# EAGLE schematic ROMS (EAGLE 9.6.2)
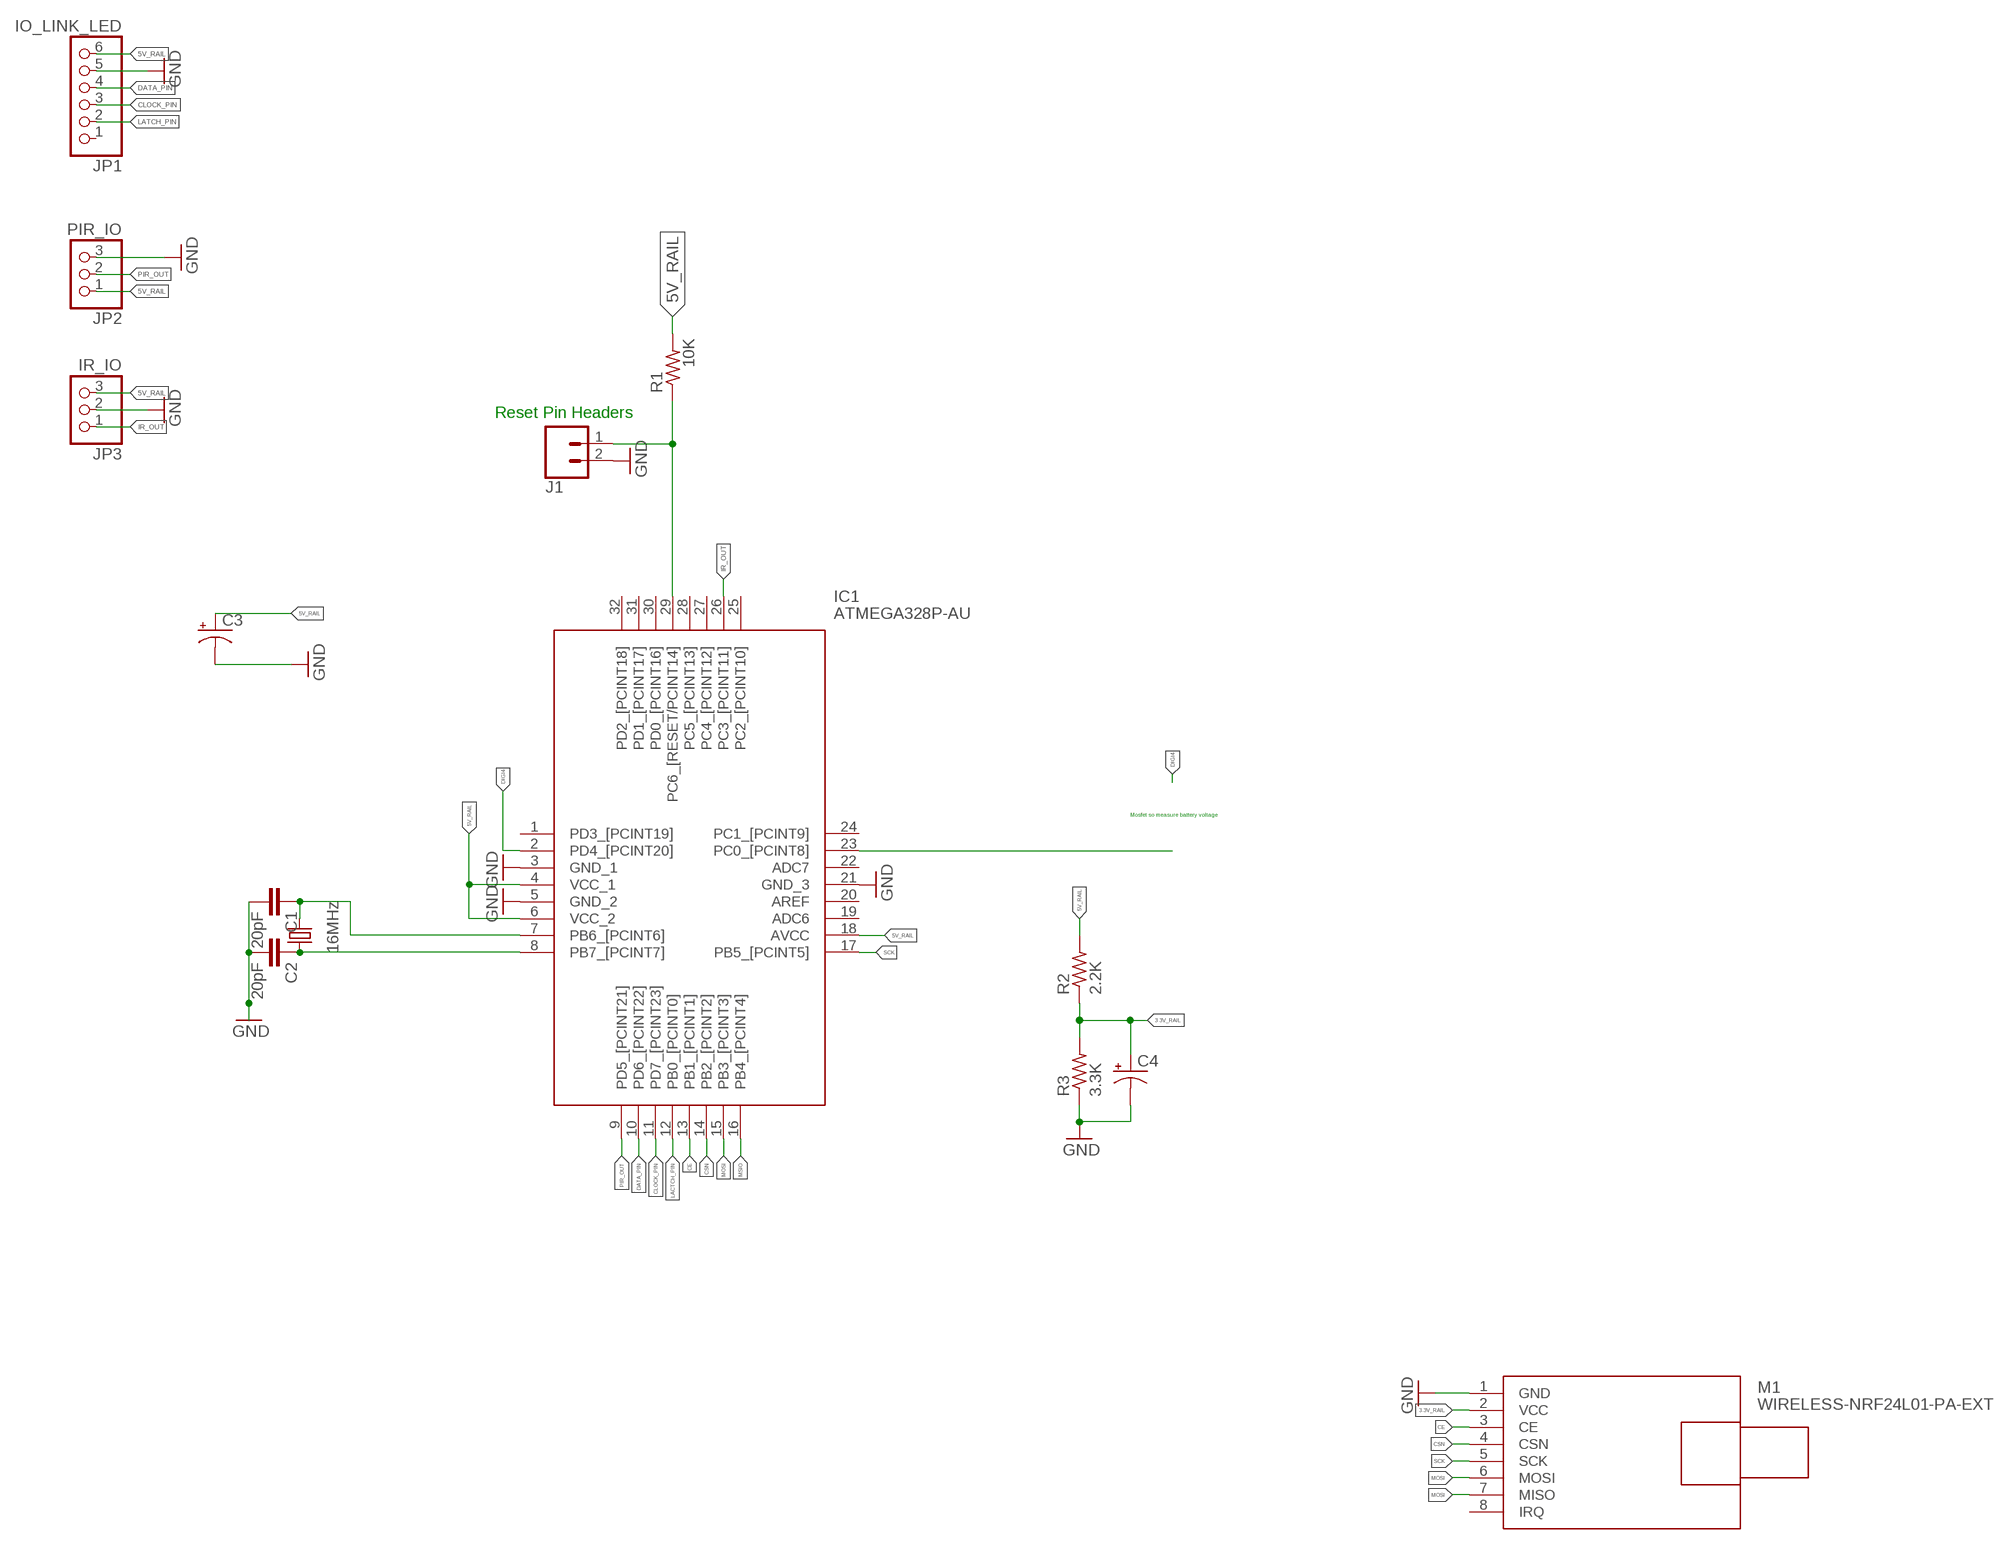
[diagram p0: schematic, sheet 1]

## Parts
C1  20pF  20PF-0402T-50V-5%  [0402-TIGHT]
C2  20pF  20PF-0402T-50V-5%  [0402-TIGHT]
C3  CPOL-USTT2D5  [TT2D5]
C4  CPOL-USTT2D5  [TT2D5]
IC1  ATMEGA328P-AU  [QFP80P900X900X120-32N]
J1  CONN_02  [1X02]
JP1  IO_LINK_LED  PINHD-1X6  [1X06]
JP2  PIR_IO  PINHD-1X3  [1X03]
JP3  IR_IO  PINHD-1X3  [1X03]
M1  WIRELESS-NRF24L01-PA-EXT  [WIRELESS-NRD24L01-PA-EXT]
R1  10K  R-US_0207/10  [0207/10]
R2  2.2K  FLIPFLOP-RES  [0805-THM]
R3  3.3K  FLIPFLOP-RES  [0805-THM]
Y1  16MHz  CRYSTAL-16MHZPTH-HC49US  [HC49US]

## Nets
3.3V_RAIL: C4.+ M1.2(VCC) R2.1 R3.2
5V_RAIL: C3.+ IC1.4(VCC_1) IC1.6(VCC_2) IC1.18(AVCC) JP1.6 JP2.1 JP3.3 R1.2 R2.2
CE: IC1.13(PB1_[PCINT1]) M1.3(CE)
CLOCK_PIN: IC1.11(PD7_[PCINT23]) JP1.3
CSN: IC1.14(PB2_[PCINT2]) M1.4(CSN)
DATA_PIN: IC1.10(PD6_[PCINT22]) JP1.4
DIGI4: IC1.2(PD4_[PCINT20])
GND: C1.2 C2.2 C3.- C4.- IC1.3(GND_1) IC1.5(GND_2) IC1.21(GND_3) J1.2 JP1.5 JP2.3 JP3.2 M1.1(GND) R3.1
IR_OUT: IC1.26(PC3_[PCINT11]) JP3.1
LACTCH_PIN: IC1.12(PB0_[PCINT0])
LATCH_PIN: JP1.2
MOSI: IC1.15(PB3_[PCINT3]) M1.6(MOSI) M1.7(MISO)
MSIO: IC1.16(PB4_[PCINT4])
N$1: C1.1 IC1.7(PB6_[PCINT6]) Y1.2
N$2: C2.1 IC1.8(PB7_[PCINT7]) Y1.1
N$3: IC1.29(PC6_[RESET/PCINT14]) J1.1 R1.1
N$4: IC1.23(PC0_[PCINT8])
PIR_OUT: IC1.9(PD5_[PCINT21]) JP2.2
SCK: IC1.17(PB5_[PCINT5]) M1.5(SCK)
Unconnected: IC1.1(PD3_[PCINT19]) IC1.19(ADC6) IC1.20(AREF) IC1.22(ADC7) IC1.24(PC1_[PCINT9]) IC1.25(PC2_[PCINT10]) IC1.27(PC4_[PCINT12]) IC1.28(PC5_[PCINT13]) IC1.30(PD0_[PCINT16]) IC1.31(PD1_[PCINT17]) IC1.32(PD2_[PCINT18]) JP1.1 M1.8(IRQ)

## Notes on the sheet
- Reset Pin Headers
- Mosfet so measure battery voltage

## Library data of the parts
C1 C2 = SparkFun-Capacitors:20PF: 20pF ceramic capacitors A capacitor is a passive two-terminal electrical component used to store electrical energy temporarily in an electric field.; PROD_ID: CAP-14843
C3 C4 = adafruit:CPOL-US: POLARIZED CAPACITOR, American symbol
IC1 = ATMEGA328P-AU:ATMEGA328P-AU: MICROCHIP - ATMEGA328P-AU. - MICROCONTROLLER MCU, 8 BIT, ATMEGA, 20MHZ, TQFP-32 Source: Datasheet <https://componentsearchengine.com/Datasheets/2/ATMEGA328P-AU.pdf>; DESCRIPTION: MICROCHIP - ATMEGA328P-AU. - MICROCONTROLLER MCU, 8 BIT, ATMEGA, 20MHZ, TQFP-32; HEIGHT: 1.2mm; MANUFACTURER_NAME: Microchip; MANUFACTURER_PART_NUMBER: ATMEGA328P-AU; MOUSER_PART_NUMBER: 556-ATMEGA328P-AU; MOUSER_PRICE-STOCK: https://www.mouser.com/Search/Refine.aspx?Keyword=556-ATMEGA328P-AU; RS_PART_NUMBER: 1310271P; RS_PRICE-STOCK: http://uk.rs-online.com/web/p/products/1310271P
J1 = SparkFun-Connectors:CONN_02: Multi connection point. Often used as Generic Header-pin footprint for 0.1 inch spaced/style header connections On any of the 0.1 inch spaced packages, you can populate with these: Break Away Headers - Straight <https://www.sparkfun.com/products/116> (PRT-00116) Break Away Male Headers - Right Angle <https://www.sparkfun.com/products/553> (PRT-00553) Female Headers <https://www.sparkfun.com/products/115> (PRT-00115) Break Away Headers - Machine Pin <https://www.sparkfun.com/products/117> (PRT-00117) Break Away Female Headers - Swiss Machine Pin <https://www.sparkfun.com/products/743> (PRT-00743) For SCREWTERMINALS and SPRING TERMINALS visit here: Screw Terimnals on SparkFun.com <https://www.sparkfun.com/search/results?term=Screw+Terminals> (5mm/3.5mm/2.54mm spacing) This device is also useful as a general connection point to wire up your design to another part of your project. Our various solder wires solder well into these plated through hole pads. Hook-Up Wire - Assortment (Stranded, 22 AWG) <https://www.sparkfun.com/products/11375> (PRT-11375) Hook-Up Wire - Assortment (Solid Core, 22 AWG) <https://www.sparkfun.com/products/11367> (PRT-11367) View the entire wire category on our website here <https://www.sparkfun.com/categories/141> Special notes: Molex polarized connector foot print use with: PRT-08233 with associated crimp pins and housings. 2.54_SCREWTERM for use with PRT-10571. 3.5mm Screw Terminal footprints for PRT-08084 5mm Screw Terminal footprints for use with PRT-08432
JP1 = adafruit:PINHD-1X6: PIN HEADER
JP2 JP3 = adafruit:PINHD-1X3: PIN HEADER
M1 = diy-modules:WIRELESS-NRF24L01-PA-EXT: 2.4 GHz Wireless Module based on NRF24L01 chip with preamplifier and external antenna
R1 = adafruit:R-US_: RESISTOR, American symbol
R2 R3 = adafruit:FLIPFLOP-RES: Flip Flop resistor An 0805 resistor inside a standard 1/4W 5% resistor. Makes for easy mods
Y1 = SparkFun-Clocks:CRYSTAL-16MHZ: 16MHz Crystal Digikey Example <http://www.digikey.com/product-search/en?keywords=535-9122-1-ND> Frequency: 16MHz Frequency Stability: ±50ppm Frequency Tolerance: ±20ppm Load Capacitance: 18pF SparkFun Products: Pro Micro -5V/16MHz <https://www.sparkfun.com/products/12640> SparkFun Serial Enabled LCD Kit <https://www.sparkfun.com/products/10097>; PROD_ID: XTAL-08181; SF_ID: COM-00536